# EAGLE design board (EAGLE 7.3.0)
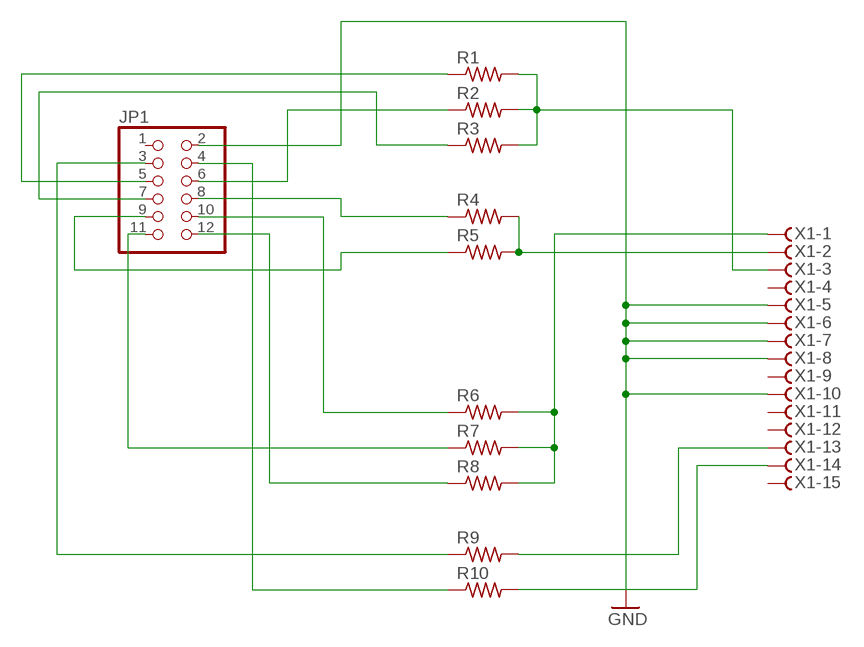
[diagram p0: schematic, sheet 1]

## Parts
JP1  PINHD-2X6  [2X06]
R1  R-US_R0805  [R0805]
R2  R-US_R0805  [R0805]
R3  R-US_R0805  [R0805]
R4  R-US_R0805  [R0805]
R5  R-US_R0805  [R0805]
R6  R-US_R0805  [R0805]
R7  R-US_R0805  [R0805]
R8  R-US_R0805  [R0805]
R9  R-US_R0805  [R0805]
R10  R-US_R0805  [R0805]
X1  F15HDHS  [HDF15H]

## Nets
GND: JP1.2 X1.5 X1.6 X1.7 X1.8 X1.10
N$1: R1.2 R2.2 R3.2 X1.3
N$2: R4.2 R5.2 X1.2
N$3: R6.2 R7.2 R8.2 X1.1
N$4: R9.2 X1.13
N$5: R10.2 X1.14
N$6: JP1.3 R9.1
N$7: JP1.4 R10.1
N$8: JP1.5 R1.1
N$9: JP1.6 R2.1
N$10: JP1.7 R3.1
N$11: JP1.8 R4.1
N$12: JP1.9 R5.1
N$13: JP1.10 R6.1
N$14: JP1.11 R7.1
N$15: JP1.12 R8.1
Unconnected: JP1.1 X1.4 X1.9 X1.11 X1.12 X1.15

## Library data of the parts
JP1 = pinhead:PINHD-2X6: PIN HEADER
R1-R10 = resistor:R-US_: RESISTOR, American symbol
X1 = con-subd:F15?S: SUB-D; OC_FARNELL: unknown; OC_NEWARK: unknown

## Board
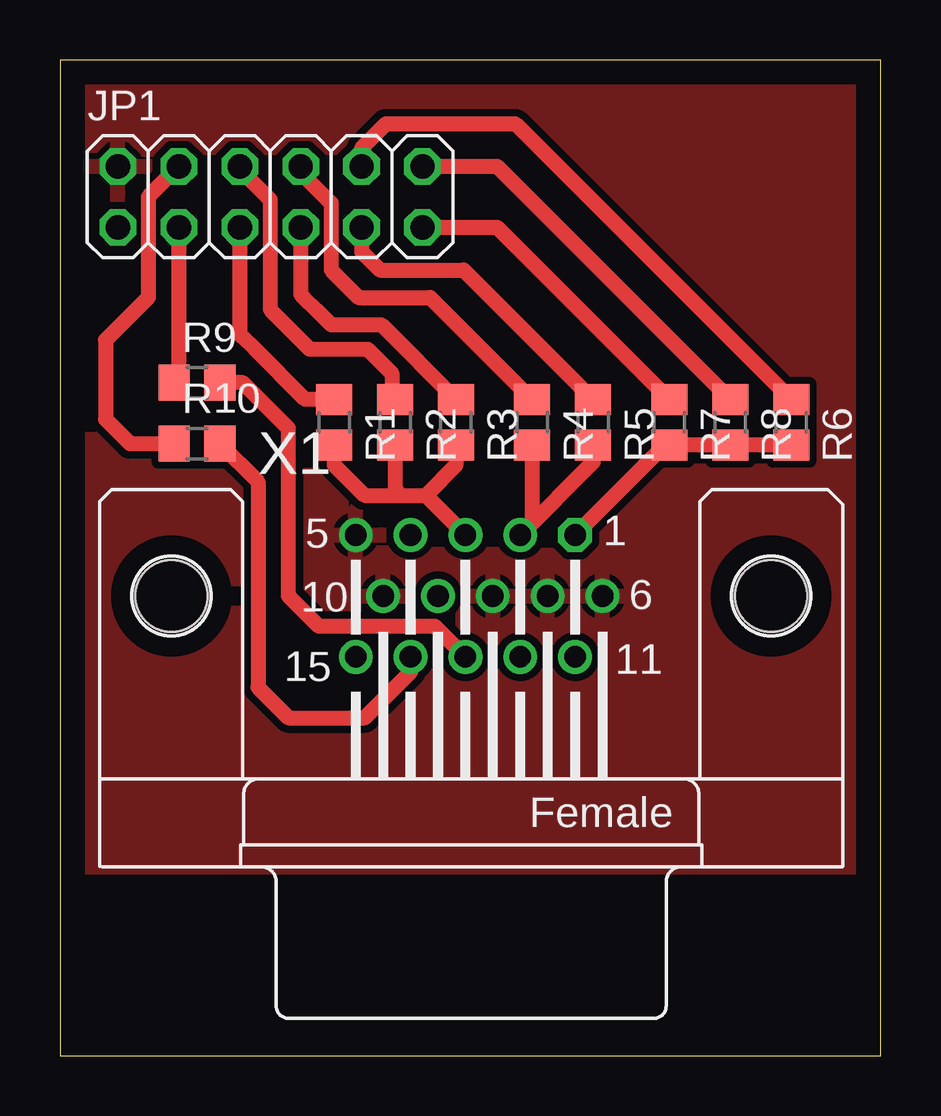
[diagram p1: board, top side]

Size 34.21 x 41.52 mm. Coordinates in mm from the lower left corner, seen from the top.
Outline: 0,0 34.21,0 34.21,41.52 0,41.52 0,0
Copper layers (1*16): Top 0.035mm / dielectric 1.5mm / Bottom 0.035mm
Design rules "default": minimum track width 10mil, minimum drill 24mil, track to track 8mil, track to pad 8mil, pad to pad 8mil, via to via 8mil, smd to smd 8mil, copper to edge 40mil, drill to drill 8mil, minimum pad ring 10mil, minimum via ring 8mil, stop-mask expansion 4mil, vias tented up to drill 0mil, thermal gap 10mil

### Footprints (pad centres in the part's own frame; a part is rotated, then mirrored left to right if it is on the bottom)
2X06 = drill 1.016 octagon: 1 -6.35,-1.27; 2 -6.35,1.27; 3 -3.81,-1.27; 4 -3.81,1.27; 5 -1.27,-1.27; 6 -1.27,1.27; 7 1.27,-1.27; 8 1.27,1.27; 9 3.81,-1.27; 10 3.81,1.27; 11 6.35,-1.27; 12 6.35,1.27
R0805 = smd 1.3 x 1.5: 1 -0.95,0; 2 0.95,0
HDF15H = drill 0.9 octagon: 1 4.329,2.54 | drill 0.9: 2 2.043,2.54; 3 -0.243,2.54; 4 -2.529,2.54; 5 -4.815,2.54; 6 5.472,0; 7 3.186,0; 8 0.9,0; 9 -1.386,0; 10 -3.672,0; 11 4.329,-2.54; 12 2.043,-2.54; 13 -0.243,-2.54; 14 -2.529,-2.54; 15 -4.815,-2.54 | hole 3: -12.5,0; 12.5,0

### Placement (x,y rotation side)
JP1  8.76,35.81 0 top
R1  11.43,26.42 270 top
R2  13.97,26.42 270 top
R3  16.51,26.42 270 top
R4  19.68,26.42 270 top
R5  22.22,26.42 270 top
R6  30.48,26.42 270 top
R7  25.4,26.42 270 top
R8  27.94,26.42 270 top
R9  5.71,28.07 0 top
R10  5.71,25.53 0 top
X1  17.14,19.18 0 top

### Tracks (layer width: path | path; a pad name or v marks a point on that pad's centre or on a via)
GND
  pour Top (isolate 0.305): 0.89,40.64 0.89,7.87 33.53,7.87 33.53,40.01 33.53,40.51 33.53,40.64
N$1
  Top 0.635: R1.2 11.43,24.64 12.7,23.37 14.22,23.37 | 14.22,23.37 15.25,23.37 | 15.25,23.37 X1.3 | R2.2 13.97,23.62 14.22,23.37 | R3.2 16.51,24.63 15.25,23.37
N$2
  Top 0.635: R5.2 22.22,24.75 X1.2 19.68,22.21 R4.2
N$3
  Top 0.635: R6.2 R8.2 R7.2 25.22,25.47 24.45,24.7 X1.1
N$4
  Top 0.635: X1.13 15.63,17.91 10.79,17.91 9.53,19.18 9.53,26.16 7.62,28.07 R9.2
N$5
  Top 0.635: R10.2 8.26,23.94 8.26,15.37 9.53,14.1 12.7,14.1 14.62,16.01 X1.14
N$6
  Top 0.635: JP1.3 4.95,28.25 R9.1
N$7
  Top 0.635: JP1.4 3.68,35.81 3.68,31.62 1.91,29.84 1.91,26.54 2.92,25.53 R10.1
N$8
  Top 0.635: R1.1 10.23,27.37 8.13,29.46 7.62,29.97 7.49,30.1 JP1.5
N$9
  Top 0.635: JP1.6 7.49,36.96 8.76,35.69 8.76,31.11 10.41,29.46 12.83,29.46 13.84,28.45 13.84,27.49 R2.1
N$10
  Top 0.635: R3.1 13.4,30.48 11.3,30.48 10.67,31.11 10.16,31.62 10.03,31.75 JP1.7
N$11
  Top 0.635: JP1.8 10.03,36.83 11.3,35.56 11.3,32.77 12.45,31.62 15.43,31.62 R4.1
N$12
  Top 0.635: R5.1 16.82,32.77 13.34,32.77 12.57,33.53 JP1.9
N$13
  Top 0.635: JP1.10 12.57,37.85 13.59,38.86 18.98,38.86 R6.1
N$14
  Top 0.635: JP1.11 18.22,34.54 R7.1
N$15
  Top 0.635: JP1.12 18.22,37.08 R8.1